# EasyEDA Pro project ProPrj_逆变电路（单相三相）_2026-01-25.epro, schematic Schematic1_2
Board Name: Board1_1; Create Date: 2025-07-18; Page Name: 逆变电路; Project Name: 复刻_逆变电路; Schematic Name: Schematic1_2; Update Date: 2025-07-18; Company: 嘉立创EDA; Page Size: A4; Version: V1.0
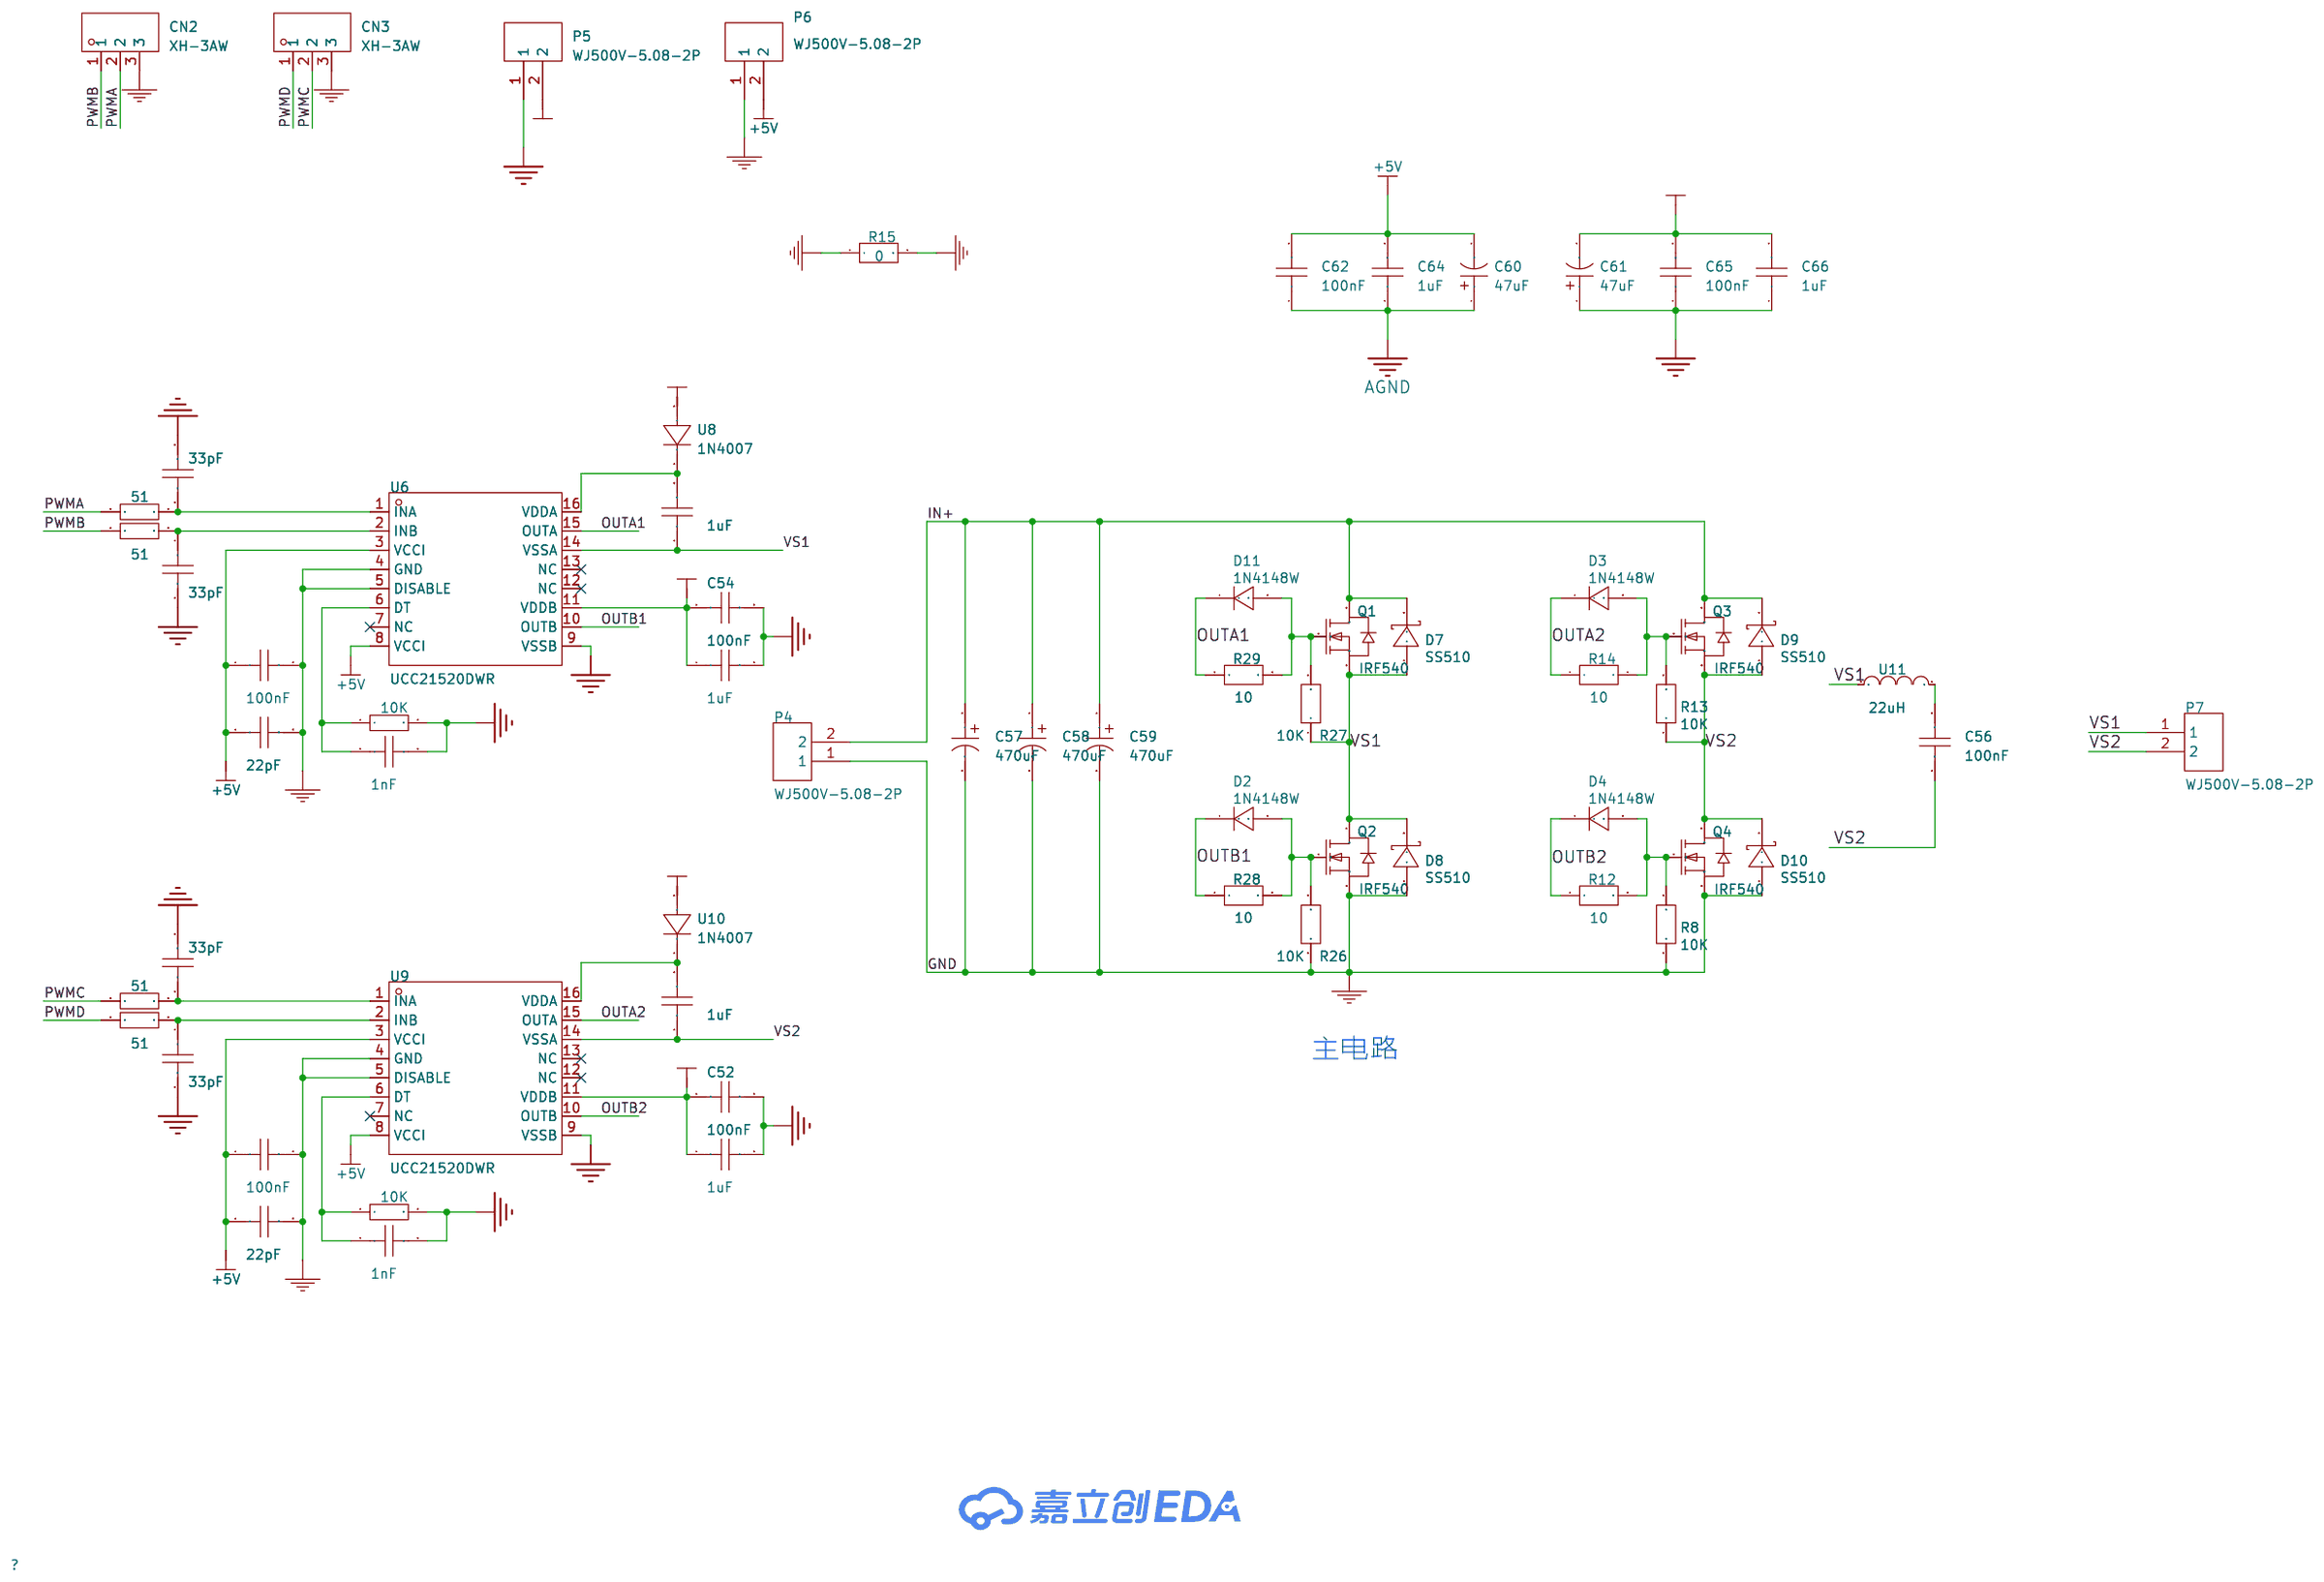
[diagram p2: schematic sheet]

## Parts
C38  33pF  [C0603]
C39  33pF  [C0603]
C42  1uF  [C0603]
C43  22pF  [C0603]
C44  100nF  [C0603]
C45  1nF  [C0603]
C46  33pF  [C0603]
C47  33pF  [C0603]
C48  1uF  [C0603]
C49  22pF  [C0603]
C50  100nF  [C0603]
C51  1nF  [C0603]
C52  100nF  [C0603]
C53  1uF  [C0603]
C54  100nF  [C0603]
C55  1uF  [C0603]
C56  100nF  [C0603]
C57  470uF  [CAP-TH_BD8.0-P3.50-D0.6-FD_1]
C58  470uF  [CAP-TH_BD8.0-P3.50-D0.6-FD_1]
C59  470uF  [CAP-TH_BD8.0-P3.50-D0.6-FD_1]
C60  47uF  [CAP-SMD_BD6.3-L6.6-W6.6-FD]
C61  47uF  [CAP-SMD_BD6.3-L6.6-W6.6-FD]
C62  100nF  [C0603]
C64  1uF  [C0603]
C65  100nF  [C0603]
C66  1uF  [C0603]
CN2  XH-3AW  [CONN-TH_3P-P2.54_HCTL_XH-3AW]
CN3  XH-3AW  [CONN-TH_3P-P2.54_HCTL_XH-3AW]
D2  1N4148W  [SOD-123FL_L2.6-W1.6-LS3.4-RD]
D3  1N4148W  [SOD-123FL_L2.6-W1.6-LS3.4-RD]
D4  1N4148W  [SOD-123FL_L2.6-W1.6-LS3.4-RD]
D7  SS510  [SMC_L7.1-W6.2-LS8.1-R-RD]
D8  SS510  [SMC_L7.1-W6.2-LS8.1-R-RD]
D9  SS510  [SMC_L7.1-W6.2-LS8.1-R-RD]
D10  SS510  [SMC_L7.1-W6.2-LS8.1-R-RD]
D11  1N4148W  [SOD-123FL_L2.6-W1.6-LS3.4-RD]
P4  WJ500V-5.08-2P  [CONN-TH_2P-P5.00_WJ500V-5.08-2P]
P5  WJ500V-5.08-2P  [CONN-TH_2P-P5.00_WJ500V-5.08-2P]
P6  WJ500V-5.08-2P  [CONN-TH_2P-P5.00_WJ500V-5.08-2P]
P7  WJ500V-5.08-2P  [CONN-TH_2P-P5.00_WJ500V-5.08-2P]
Q1  IRF540  [TO-220AB-3_L10.4-W4.6-P2.54-L]
Q2  IRF540  [TO-220AB-3_L10.4-W4.6-P2.54-L]
Q3  IRF540  [TO-220AB-3_L10.4-W4.6-P2.54-L]
Q4  IRF540  [TO-220AB-3_L10.4-W4.6-P2.54-L]
R8  10K  [R0603]
R12  10  [R0805]
R13  10K  [R0603]
R14  10  [R0805]
R15  0  [R0805]
R26  10K  [R0603]
R27  10K  [R0603]
R28  10  [R0805]
R29  10  [R0805]
R30  51  [R0603]
R31  51  [R0603]
R32  10K  [R0603]
R33  51  [R0603]
R34  51  [R0603]
R35  10K  [R0603]
U6  UCC21520DWR  [SOIC-16_L10.3-W7.5-P1.27-LS10.3-BL]
U8  1N4007  [SMA_L4.3-W2.6-LS5.1-RD]
U9  UCC21520DWR  [SOIC-16_L10.3-W7.5-P1.27-LS10.3-BL]
U10  1N4007  [SMA_L4.3-W2.6-LS5.1-RD]
U11  22uH  [IND-TH_L14.0-W6.5-P8.00-D0.6]

## Library data of the parts
C38 C39 C42-C55 = CAP_0603: Supplier Footprint: 0603
C56 C62 C64-C66 = CGA0603X7R104K500JT: 容值:100nF;精度:±10%;额定电压:50V;温度系数:X7R;; LCSC Part Name: 100nF ±10% 50V; Supplier Part: C6119867; Manufacturer: HRE(芯声); Supplier Footprint: 0603; JLCPCB Part Class: 扩展库; Datasheet: https://atta.szlcsc.com/upload/public/pdf/source/20250103/C44077DA9E7B3EFAE02F22B6D3D1CBC9.pdf; Supplier: LCSC; Tolerance: ±10%; Voltage Rating: 50V; Temperature Coefficient: X7R
C57-C59 = CD2884771EM0812VFL: 容值:470uF;额定电压:25V;; LCSC Part Name: 470uF 25V; Supplier Part: C2960233; Manufacturer: HRK(鸿瑞凯电子); Supplier Footprint: 插件,D8xL12mm; JLCPCB Part Class: 扩展库; Datasheet: https://atta.szlcsc.com/upload/public/pdf/source/20240703/D49961C1CEC6E325964F7113D69E9087.pdf; Supplier: LCSC; Rated Voltage: 25V; φD: 8mm; L: 12mm; Operating Temperature: -40℃~+105℃
C60 C61 = JVJ50V47M6x8: 容值:47uF;精度:±20%;额定电压:50V;纹波电流:63mA@100Hz;; LCSC Part Name: 47uF ±20% 50V; Supplier Part: C46550421; Manufacturer: 捷而瑞; Supplier Footprint: SMD,D6.3xL7.7mm; JLCPCB Part Class: 扩展库; Datasheet: https://atta.szlcsc.com/upload/public/pdf/source/20250507/08B970F4447803D1DFB8733A1F628099.pdf; Supplier: LCSC; Tolerance: ±20%; Voltage Rating: 50V; Ripple Current: 63mA@100Hz; Diameter: 6.3mm; Height - Seated (Max): 7.7mm; Lifetime: 2000hrs@105℃; Operating Temperature: -55℃~+105℃
CN2 CN3 = XH-3AW_C2908612: 插针结构:1x3P;间距:2.54mm;安装方式:弯插;参考系列:XH;总PIN数:3P;排数:1;每排PIN数:3;行距:-;额定电流:3A;触头材质:黄铜;触头镀层:锡;工作温度范围:-25℃~+85℃;; LCSC Part Name: 1x3P 间距:2.54mm 弯插 系列:XH; Supplier Part: C2908612; Manufacturer: HCTL(华灿天禄); Supplier Footprint: 弯插,P=2.5mm; JLCPCB Part Class: 扩展库; Datasheet: https://atta.szlcsc.com/upload/public/pdf/source/20230711/B565BAF3B11666EF6B81B3605408F2BD.pdf; Supplier: LCSC; Pins Structure: 1x3P; Pitch: 2.54mm; Mounting Style: 弯插; Reference Series: XH; Number of Pins: 3P; Number of Rows: 1; Number of PINs Per Row: 3; Current Rating (Max): 3A; Contact Material: 黄铜; Contact Plating: 锡; Operating Temperature Range: -25℃~+85℃
D2-D4 D11 = 1N4148W: Supplier: LCSC; Manufacturer: Tak Cheong; Supplier Part: C129216
D7-D10 = SS510: Supplier: LCSC; Manufacturer: MDD; Supplier Part: C19229; JLCPCB Part Class: Extended Part
P4-P7 = WJ500V-5.08-2P: 结构:1x2P;间距:5.08mm;颜色:绿色;安装方式:直插;额定电流:18A;额定电压:250V;排数:1;线规 - AWG:14~30;线规 - 平方毫米:2.5;每排PIN数:2;触头材质:-;触头镀层:-;工作温度范围:-40℃~+105℃;焊接温度(最大值):-;; LCSC Part Name: 1x2P 5.08mm 直插 排数:1 每排P数:2; Supplier Part: C8465; Manufacturer: KANGNEX(康奈克斯电气); Supplier Footprint: 插件,P=5.08mm; JLCPCB Part Class: 扩展库; Datasheet: https://atta.szlcsc.com/upload/public/pdf/source/20191225/C8465_02D34CE5B5B4A53DF5891601D97FA9F4.pdf; Supplier: LCSC; Structure: 1x2P; Pitch: 5.08mm; Color: 绿色; Mounting Style: 直插; Current Rating (Max): 18A; Voltage Rating (Max): 250V; Number of Pins: 2P; Number of Rows: 1; Wire Gauge - AWG: 14~30; Wire Gauge - mm2: 2.5; Number of PINs Per Row: 2; Operating Temperature Range: -40℃~+105℃; Screw Specification: M2.5
Q1-Q4 = IRF540: Supplier: LCSC; Supplier Part: C533268; Manufacturer: Infineon Technologies; Manufacturer Part: AUIRF540Z; JLCPCB Part Class: Extended Part
R8 R13 R26 R27 = 10K
R12 R14 R28 R29 = 10
R15 = 0
R30-R35 = Res_0603: Supplier Footprint: 0603
U6 U9 = UCC21520DWR: UCC21520 4A/6A、5.7 kVrms 双通道隔离式栅极驱动器; Supplier Part: C601651; Manufacturer: TI(德州仪器); Supplier Footprint: SOIC-16-300mil; JLCPCB Part Class: 扩展库; Datasheet: https://www.ti.com/cn/lit/gpn/ucc21520; Supplier: LCSC
U8 U10 = 1N4007: Supplier Part: C9900004759; JLCPCB Part Class: Extended Part; Supplier: LCSC
U11 = SLT044125T220MUB: 电感值:22uH;精度:±20%;额定电流:3A;饱和电流(Isat):-;类型:磁环电感;Q值:-;; LCSC Part Name: 磁环电感 22uH ±20%; Supplier Part: C326005; Manufacturer: Sunltech(韩国顺磁); Supplier Footprint: 插件; JLCPCB Part Class: 扩展库; Datasheet: https://atta.szlcsc.com/upload/public/pdf/source/20181123/C326005_A109349052D422CC6549E09D1F005FCE.pdf; Supplier: LCSC; Tolerance: ±20%; Rated Current: 3A; DC Resistance: 38mΩ; Type: 磁环电感

## Nets
+5V: C43.1 C44.1 C49.1 C50.1 C60.2 C62.2 C64.2 P6.2 U6.3(VCCI) U6.8(VCCI) U9.3(VCCI) U9.8(VCCI)
+12V: C52.1 C53.1 C54.1 C55.1 C61.2 C65.2 C66.2 P5.2 U6.11(VDDB) U8.2(A) U9.11(VDDB) U10.2(A)
AGND: C38.2 C39.2 C43.2 C44.2 C45.2 C46.2 C47.2 C49.2 C50.2 C51.2 C60.1 C62.1 C64.1 CN2.3 CN3.3 P6.1 R15.1 R32.2 R35.2 U6.4(GND) U6.5(DISABLE) U9.4(GND) U9.5(DISABLE)
GND: C52.2 C53.2 C54.2 C55.2 C57.2 C58.2 C59.2 C61.1 C65.1 C66.1 D8.1(A) D10.1(A) P4.1 P5.1 Q2.3(S) Q4.3(S) R8.1 R15.2 R26.1 U6.9(VSSB) U9.9(VSSB)
IN+: C57.1 C58.1 C59.1 D7.2(K) D9.2(K) P4.2 Q1.2(D) Q3.2(D)
OUTA1: D11.1 R29.1 U6.15(OUTA)
OUTA2: D3.1 R14.1 U9.15(OUTA)
OUTB1: D2.1 R28.1 U6.10(OUTB)
OUTB2: D4.1 R12.1 U9.10(OUTB)
PWMA: CN2.2 R30.1
PWMB: CN2.1 R31.1
PWMC: CN3.2 R33.1
PWMD: CN3.1 R34.1
VS1: C42.1 D7.1(A) D8.2(K) P7.1 Q1.3(S) Q2.2(D) R27.1 U6.14(VSSA) U11.1
VS2: C48.1 C56.1 D9.1(A) D10.2(K) P7.2 Q3.3(S) Q4.2(D) R13.1 U9.14(VSSA)
$1N3008: D4.2 Q4.1(G) R8.2 R12.2
$1N3011: D3.2 Q3.1(G) R13.2 R14.2
$1N3020: D2.2 Q2.1(G) R26.2 R28.2
$1N3021: D11.2 Q1.1(G) R27.2 R29.2
$1N3645: C38.1 R30.2 U6.1(INA)
$1N3671: C39.1 R31.2 U6.2(INB)
$1N3989: C42.2 U6.16(VDDA) U8.1(K)
$1N4175: C45.1 R32.1 U6.6(DT)
$1N5130: C46.1 R33.2 U9.1(INA)
$1N5132: C47.1 R34.2 U9.2(INB)
$1N5148: C48.2 U9.16(VDDA) U10.1(K)
$1N5162: C51.1 R35.1 U9.6(DT)
$1N6990: C56.2 U11.2

Not connected (* = marked no-connect by the designer): U6 7(NC)* 12(NC)* 13(NC)*; U9 7(NC)* 12(NC)* 13(NC)*

## Notes on the sheet
- 主电路
